# Altium schematic sheet SCH-6-ESC4.SchDoc
size Letter
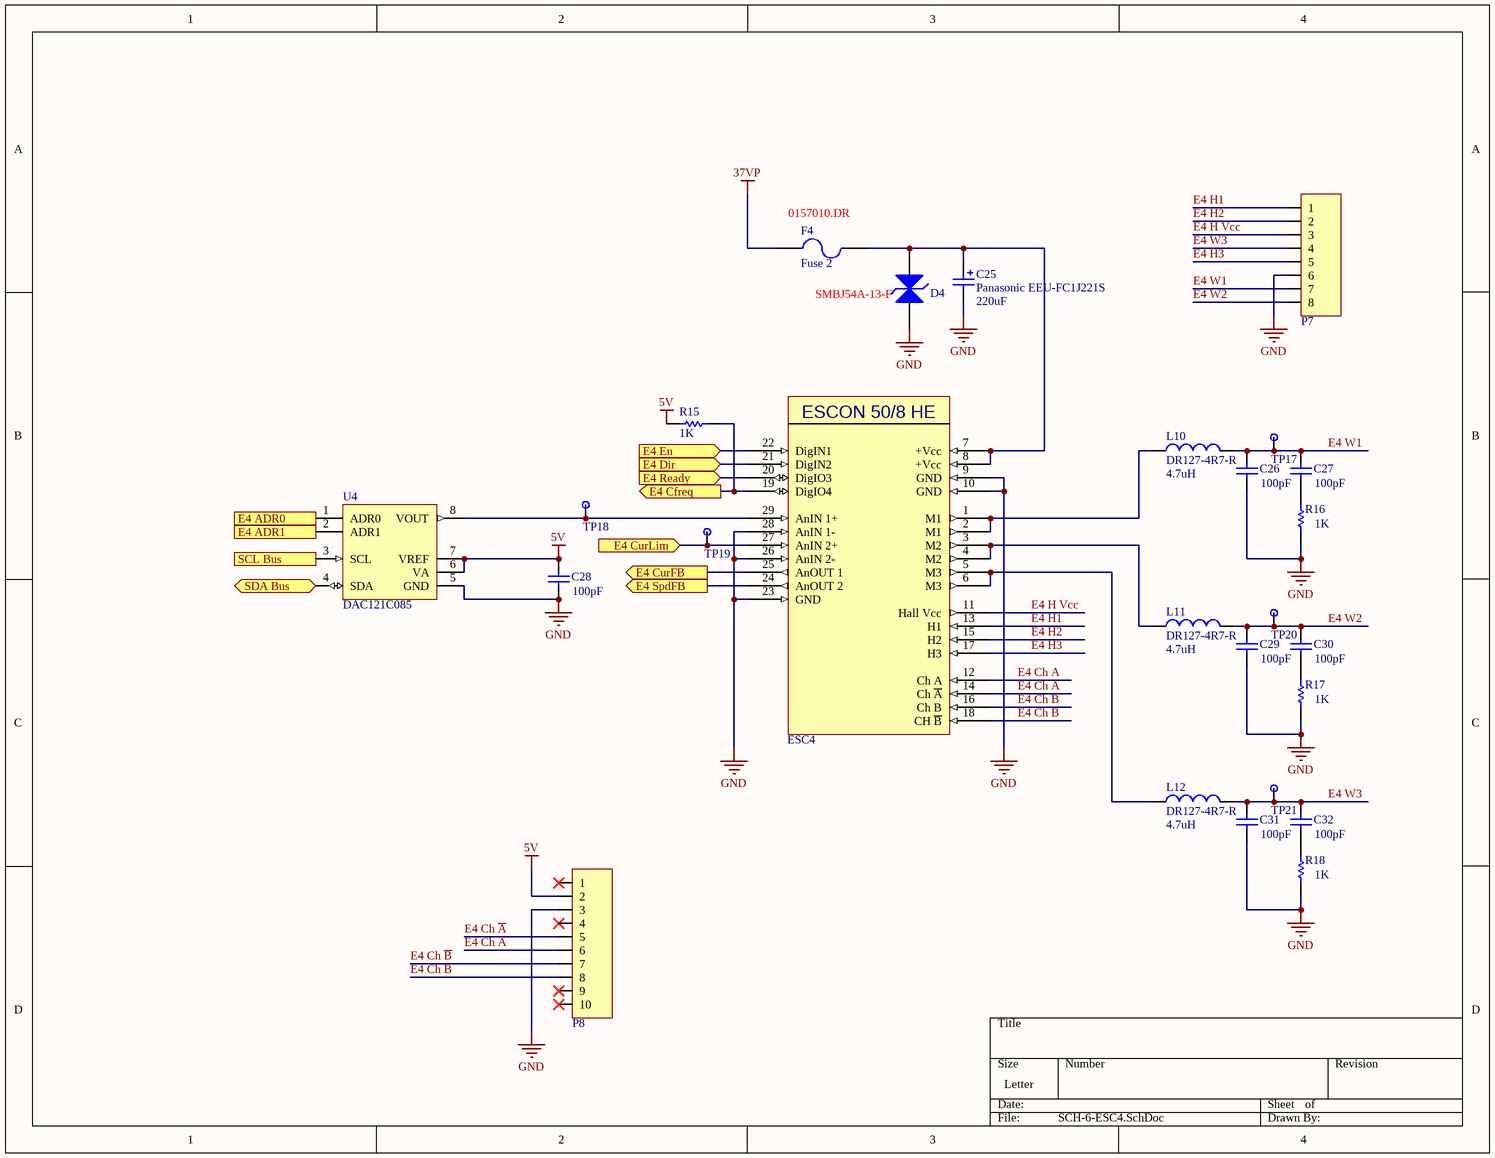
[diagram p0: SCH-6-ESC4.SchDoc]

## Parts
C25  Panasonic EEU-FC1J221S  value 220uF  [Panasonic EEU-FC1J221S]
C26  value 100pF  [C1206]  (hidden comment: Cap Semi)
C27  value 100pF  [C1206]  (hidden comment: Cap Semi)
C28  value 100pF  [C1206]  (hidden comment: Cap Semi)
C29  value 100pF  [C1206]  (hidden comment: Cap Semi)
C30  value 100pF  [C1206]  (hidden comment: Cap Semi)
C31  value 100pF  [C1206]  (hidden comment: Cap Semi)
C32  value 100pF  [C1206]  (hidden comment: Cap Semi)
D4  TVS_DIODE  [SMBJ54A-13-F]  (value not drawn)
ESC4  ESCON 50/8 HE  [ESCON 50/8 HE]  (value not drawn)
F4  Fuse 2  [0157010.DR]
L10  DR127-4R7-R  value 4.7uH  [DR127-4R7-R]
L11  DR127-4R7-R  value 4.7uH  [DR127-4R7-R]
L12  DR127-4R7-R  value 4.7uH  [DR127-4R7-R]
P7  0039281083  [Molex Mini-Fit Jr 0039281083]  (value not drawn)
P8  Header_10_Pos_Ribbon Male  [3M_2510-6002UB]  (value not drawn)
R15  value 1K  [RESC1608X06N_0603]  (hidden comment: Res1)
R16  value 1K  [RESC1608X06N_0603]  (hidden comment: Res1)
R17  value 1K  [RESC1608X06N_0603]  (hidden comment: Res1)
R18  value 1K  [RESC1608X06N_0603]  (hidden comment: Res1)
TP17  TestPt  [50_MIL_PAD]  (value not drawn)
TP18  TestPt  [50_MIL_PAD]  (value not drawn)
TP19  TestPt  [50_MIL_PAD]  (value not drawn)
TP20  TestPt  [50_MIL_PAD]  (value not drawn)
TP21  TestPt  [50_MIL_PAD]  (value not drawn)
U4  DAC121C085  [MUA08A_L]

## Ports
E4 ADR0 (in), E4 ADR1 (in), E4 Cfreq (out), E4 CurFB (out), E4 CurLim (in), E4 Dir (in), E4 En (in), E4 Ready (in), E4 SpdFB (out), SCL Bus (in), SDA Bus (bidir)

## Nets
5V: C28.2 P8.2 R15.2 U4.6(VA) U4.7(VREF)
37VP: F4.1
GND: C25.2 C26.1 C28.1 C29.1 C31.1 D4.1(A) ESC4.9(GND) ESC4.10(GND) ESC4.23(GND) ESC4.26(AnIN_2-) ESC4.28(AnIN_1-) P7.6 P8.3 R16.1 R17.1 R18.1 U4.5(GND)
E4 ADR0: U4.1(ADR0) ; port E4 ADR0
E4 ADR1: U4.2(ADR1) ; port E4 ADR1
E4 Cfreq: ESC4.19(DigIO4) R15.1 ; port E4 Cfreq
E4 Ch A: ESC4.12(Ch_A) P8.6
E4 Ch ~{A}: ESC4.14(Ch_~{A}) P8.5
E4 Ch B: ESC4.16(Ch_B) P8.8
E4 Ch ~{B}: ESC4.18(CH_~{B}) P8.7
E4 CurFB: ESC4.25(AnOUT_1) ; port E4 CurFB
E4 CurLim: ESC4.27(AnIN_2+) TP19.1 ; port E4 CurLim
E4 Dir: ESC4.21(DigIN2) ; port E4 Dir
E4 En: ESC4.22(DigIN1) ; port E4 En
E4 H1: ESC4.13(H1) P7.1
E4 H2: ESC4.15(H2) P7.2
E4 H3: ESC4.17(H3) P7.5
E4 H Vcc: ESC4.11(Hall_Vcc) P7.3
E4 Ready: ESC4.20(DigIO3) ; port E4 Ready
E4 SpdFB: ESC4.24(AnOUT_2) ; port E4 SpdFB
E4 W1: C26.2 C27.2 L10.2 P7.7 TP17.1
E4 W2: C29.2 C30.2 L11.2 P7.8 TP20.1
E4 W3: C31.2 C32.2 L12.2 P7.4 TP21.1
SCL Bus: U4.3(SCL) ; port SCL Bus
SDA Bus: U4.4(SDA) ; port SDA Bus
NetC25_1: C25.1 D4.2(K) ESC4.7(+Vcc) ESC4.8(+Vcc) F4.2
NetC27_1: C27.1 R16.2
NetC30_1: C30.1 R17.2
NetC32_1: C32.1 R18.2
NetESC4_1: ESC4.1(M1) ESC4.2(M1) L10.1
NetESC4_3: ESC4.3(M2) ESC4.4(M2) L11.1
NetESC4_5: ESC4.5(M3) ESC4.6(M3) L12.1
NetESC4_29: ESC4.29(AnIN_1+) TP18.1 U4.8(VOUT)

Not connected (* = marked no-connect by the designer): P8 1* 4* 9* 10*

## Notes on the sheet
- (near F4) 0157010.DR
- (near D4) SMBJ54A-13-F

## Library data of the parts
C25 = Panasonic EEU-FC1J221S: Polarized Capacitor (Radial)
C26-C32 = Cap Semi: Capacitor (Semiconductor SIM Model); Published: 8-Jun-2000; LatestRevisionDate: 29-May-2009; LatestRevisionNote: IPC-7351 Footprint Added.; PackageReference: C1206; Publisher: Altium Limited; PackageDescription: Chip Capacitor
D4 = TVS_DIODE: TVS Diode; Published: 8-Jun-2000; LatestRevisionDate: 17-Jul-2002; LatestRevisionNote: Re-released for DXP Platform.; PackageVersion: Sep-1996; PackageReference: SMC; Publisher: Altium Limited; PackageDescription: DO-214-AB/SMC; 2 C-Bend Leads; Body 7.9 x 5.9 mm, inc. leads (LxW); Code_JEDEC: DO-214-AB
ESC4 = ESCON 50/8 HE: ESCON Module 50/8 HE Servocontroller
F4 = Fuse 2: Fuse; Published: 8-Jun-2000; LatestRevisionDate: 17-Jul-2002; LatestRevisionNote: Re-released for DXP Platform.; PackageReference: PIN-W2/E2.8; Publisher: Altium Limited; PackageDescription: Thru-Hole; 2 Leads
L10-L12 = DR127-4R7-R: 4.7µH Shielded Wirewound Inductor 8.25A 9.17mOhm Nonstandard; Code_IEC: 1005; Published: 8-Jun-2000; LatestRevisionDate: 29-May-2009; LatestRevisionNote: IPC-7351 Footprint Added.; PackageReference: 0402-A; Publisher: Altium Limited; PackageDescription: Chip Inductor; Code_JEITA: 0402
P7 = Molex Mini-Fit Jr 8pos Vert: Mini-Fit Jr, 8 pos 2 row
P8 = Header_10_Pos_Ribbon Male: IDC, 10 pos, Male
R15-R18 = Res1: Resistor; Published: 8-Jun-2000; LatestRevisionDate: 17-Jul-2002; LatestRevisionNote: Re-released for DXP Platform.; PackageReference: AXIAL-0.3; Publisher: Altium Limited; PackageDescription: Axial Device, Thru-Hole; 2 Leads; 0.3 in Pin Spacing
U4 = DAC121C085: 12-Bit Micro Power Digital-to-Analog Converter with an I2C-Compatible Interface and External Reference, 8-pin Mini SOIC, Pb-Free; Manufacturer: National Semiconductor; PackageTopMarking: XTT*X90C; PowerWise: Y; CompType: D/A Converter; ComponentLink3URL: http://www.national.com/packaging/folders/mua08a.html; ComponentLink2URL: http://www.national.com/pf/DA/DAC121C085.html; Code_JEDEC: MO-187-AA; ComponentLink1URL: http://www.national.com/ds/DA/DAC121C085.pdf; RoHS: Y; PackageVersion: revF, Apr-2008; PackageDescription: MINI SOIC, .118 x .118 x .034in, 8 Lead, .0256in Pitch; PackageReference: MUA08A; PinCount: 8; DatasheetVersion: Mar-2008; ComponentLink1Description: DAC121C085 Datasheet; ComponentLink2Description: DAC121C085 Web Page; ComponentLink3Description: MUA08A Package Page; RevisionNote: Component URLs added